# Altium schematic sheet Main_Trigger.SchDoc (part 1 of 2)
size A0; DocumentNumber: 1; SheetNumber: 1; SheetTotal: 6
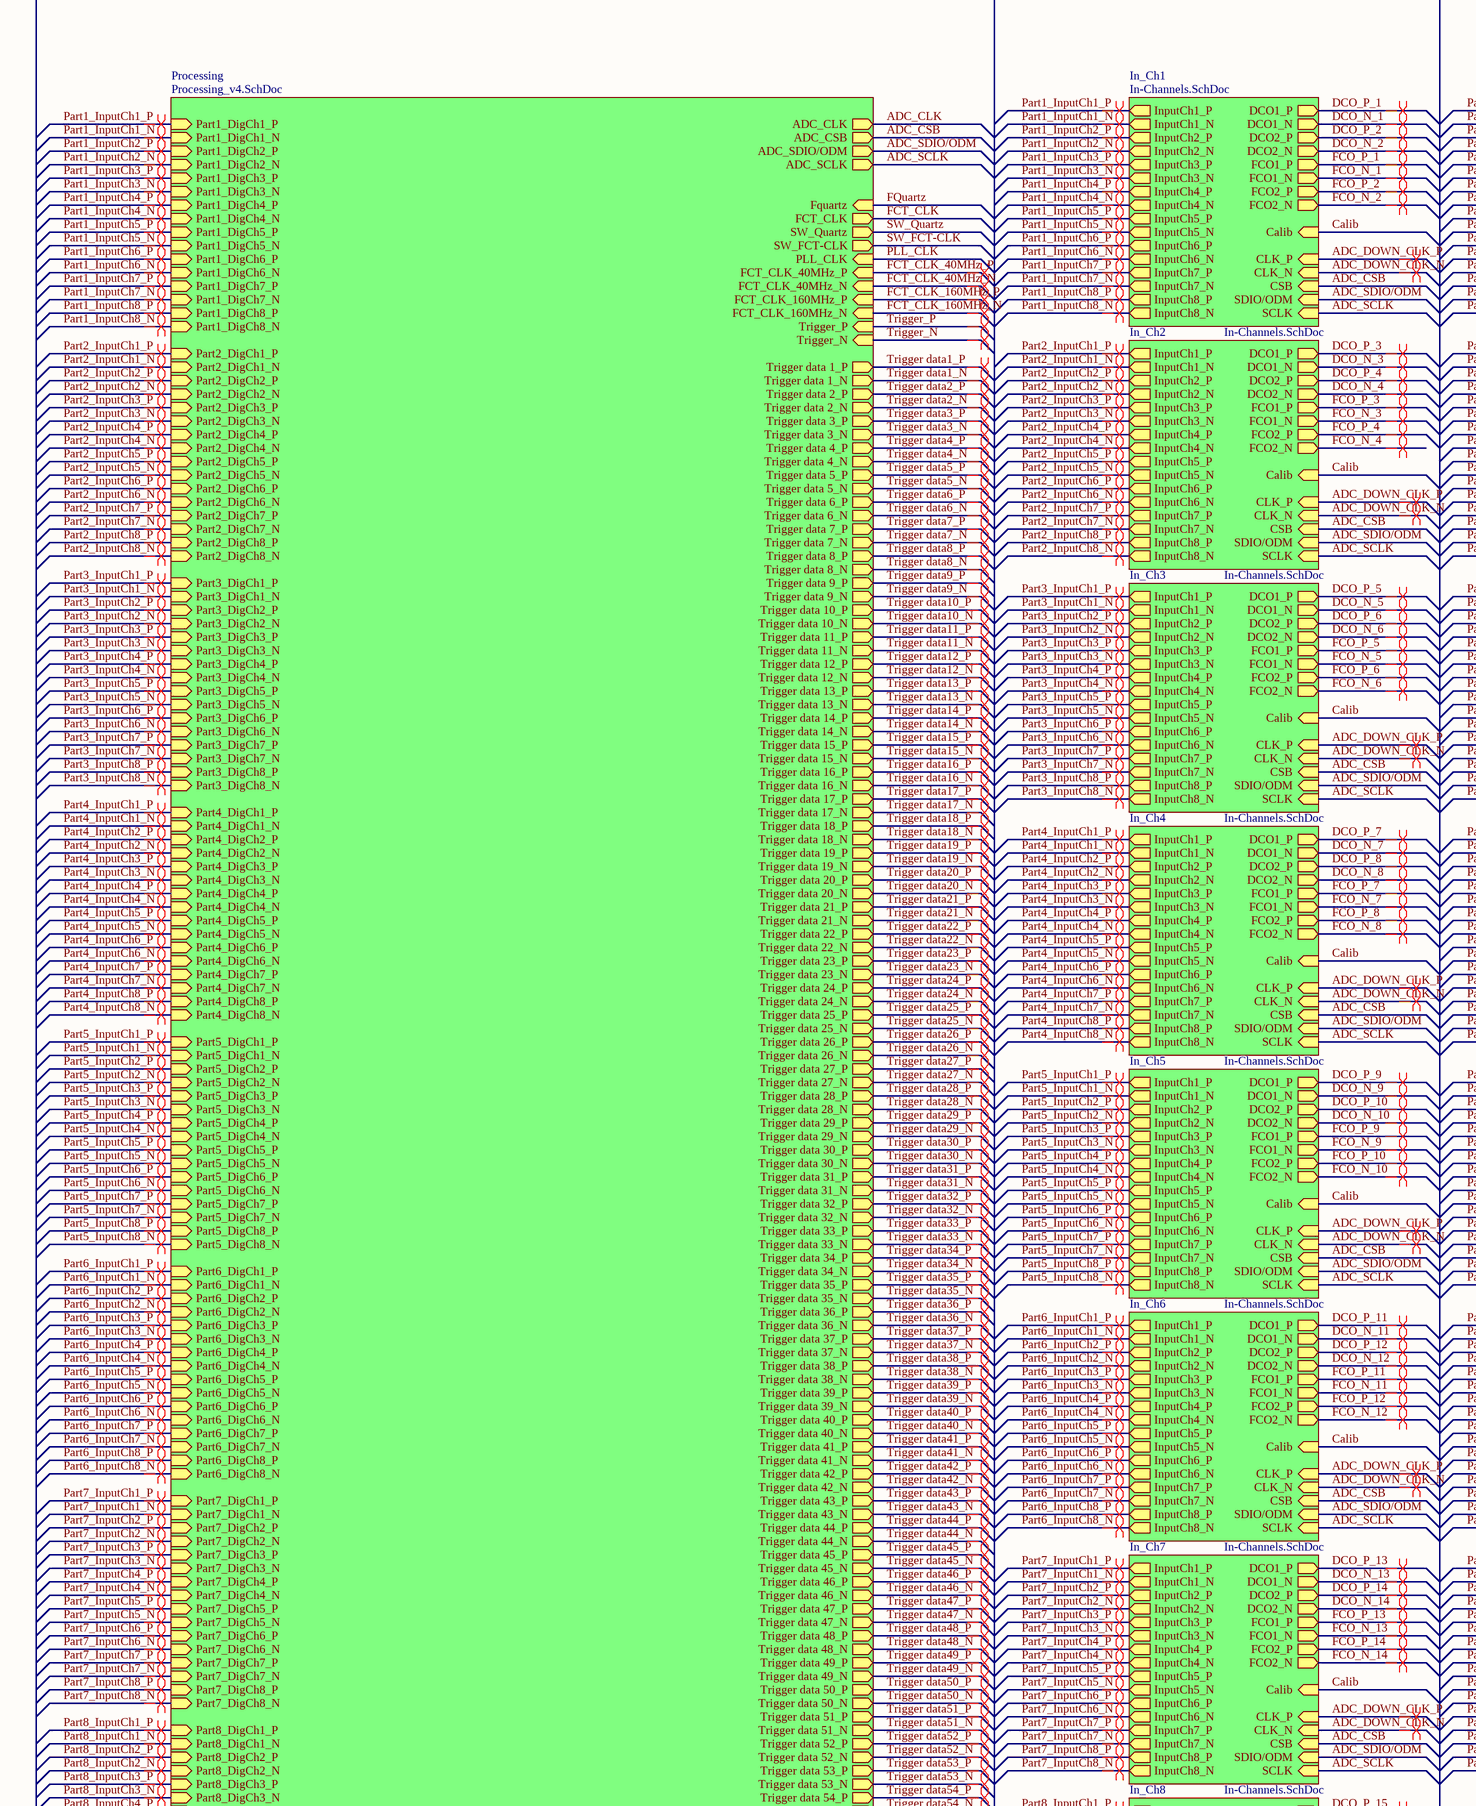
[diagram p0: Main_Trigger.SchDoc, top left]
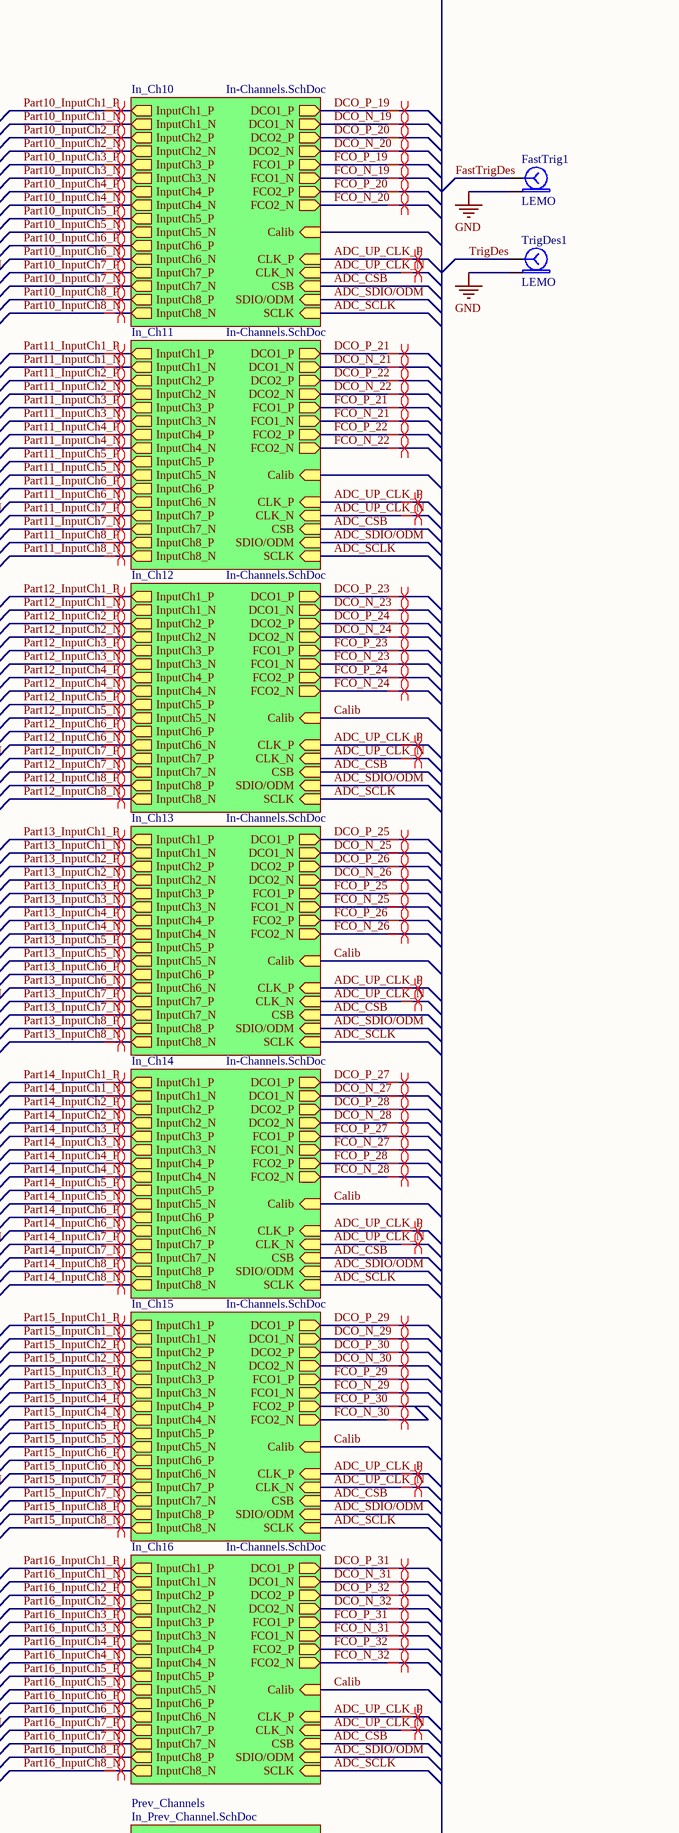
[diagram p1: Main_Trigger.SchDoc, top middle]
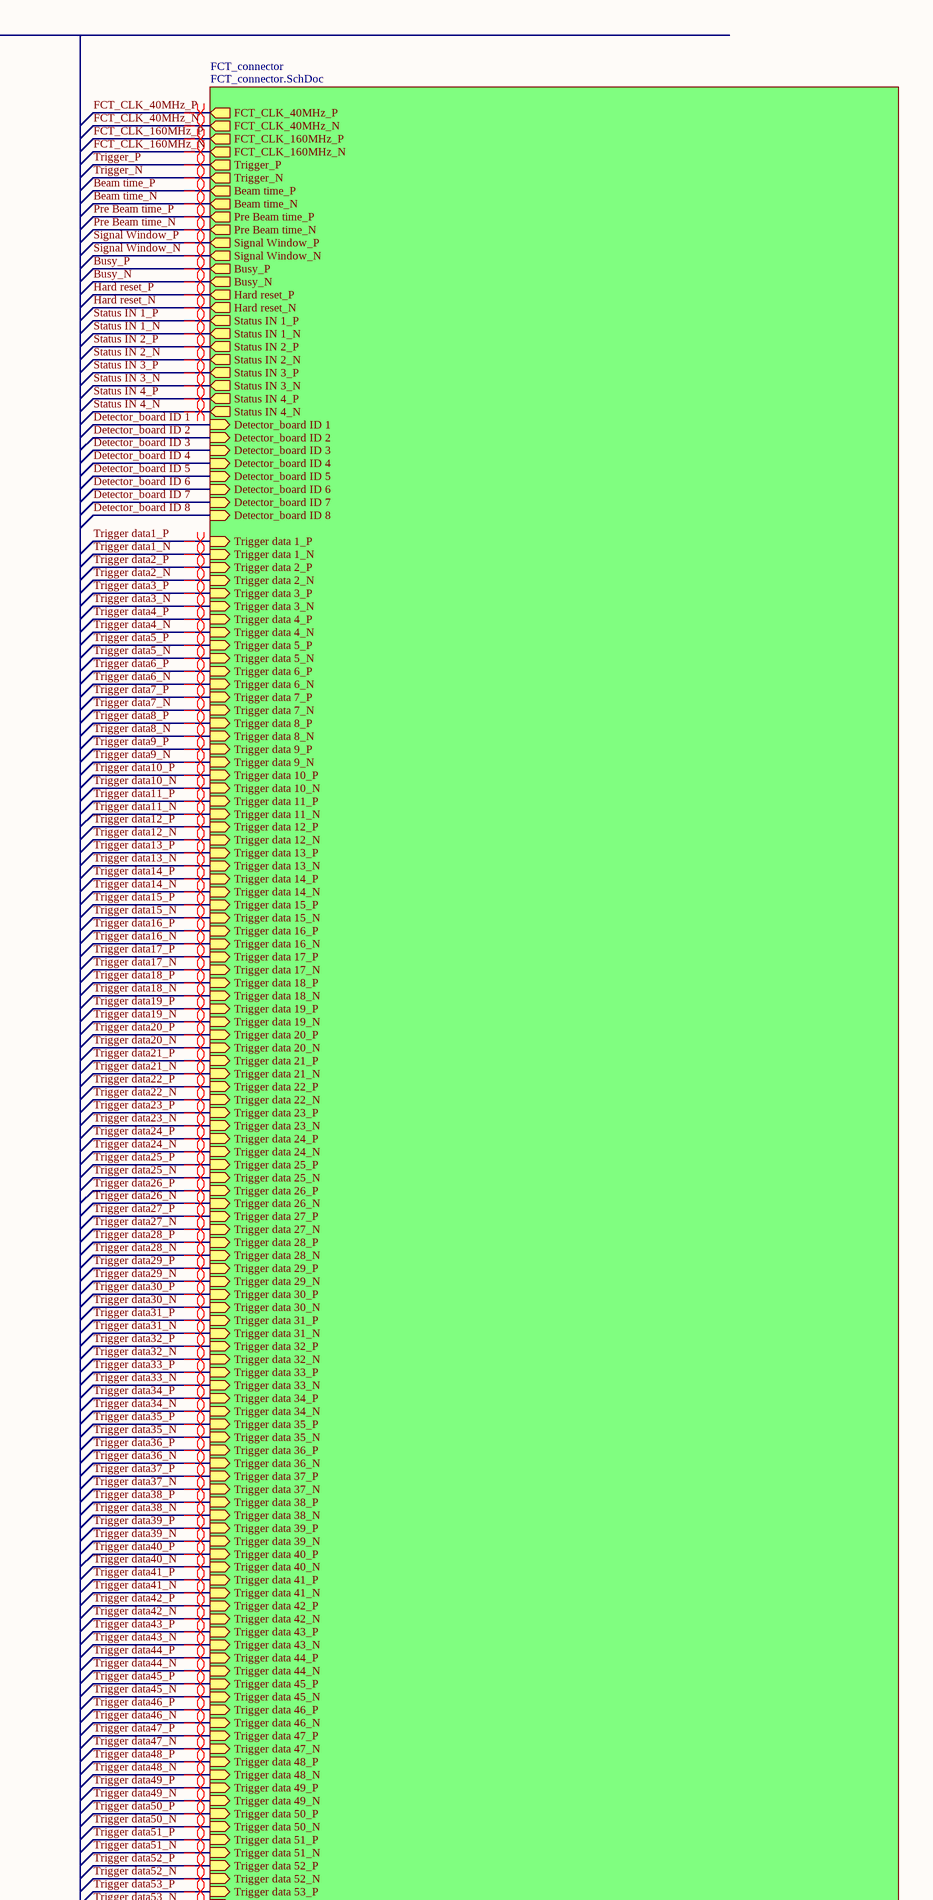
[diagram p2: Main_Trigger.SchDoc, top right]
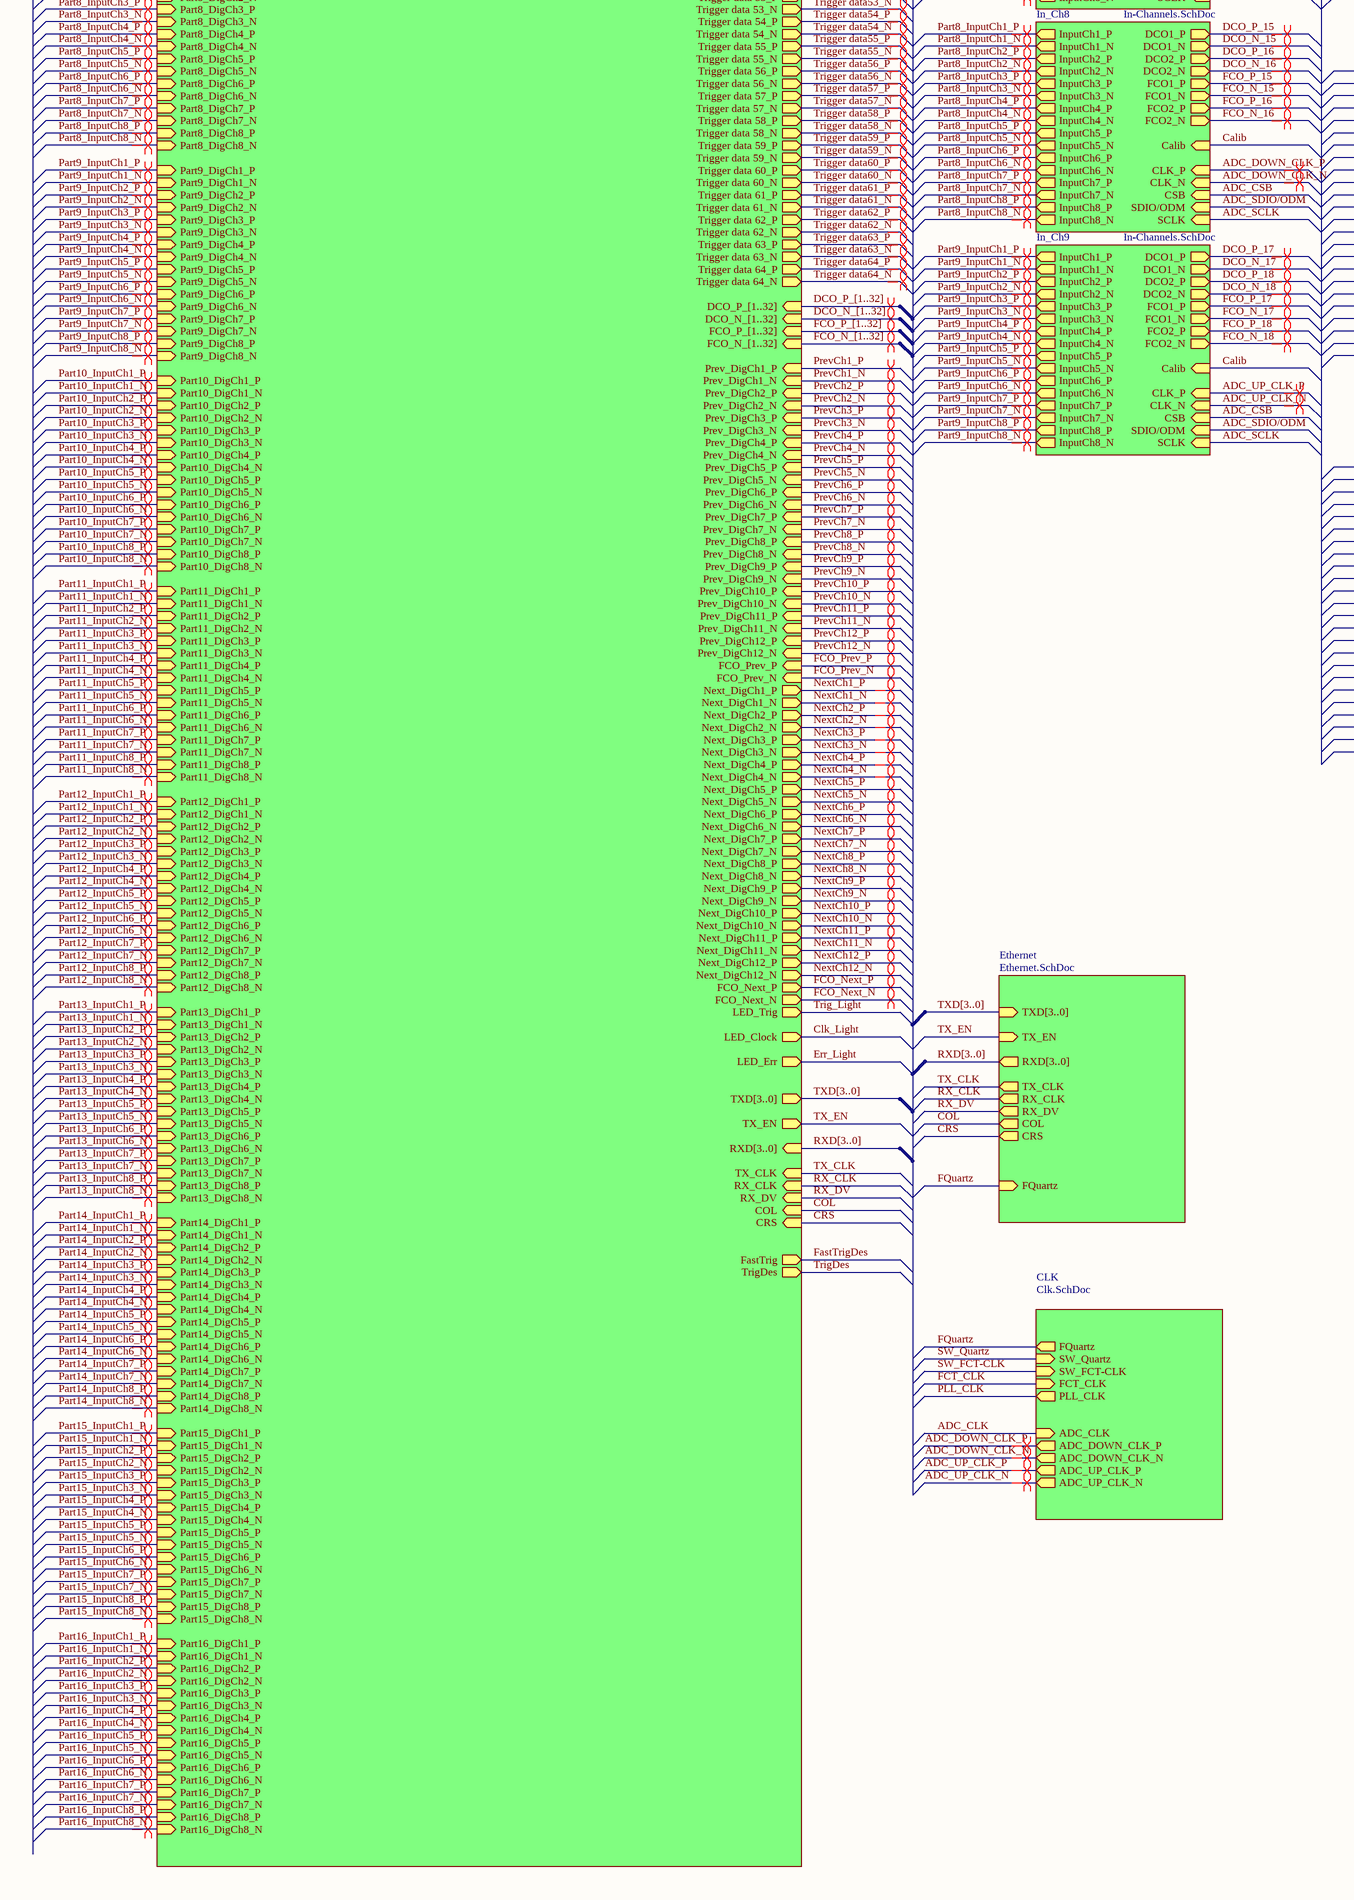
[diagram p3: Main_Trigger.SchDoc, bottom left]
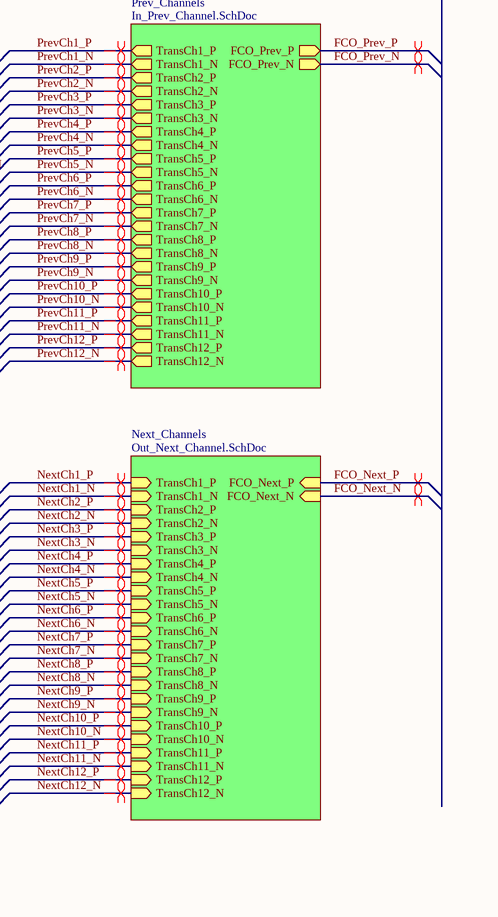
[diagram p4: Main_Trigger.SchDoc, bottom middle]
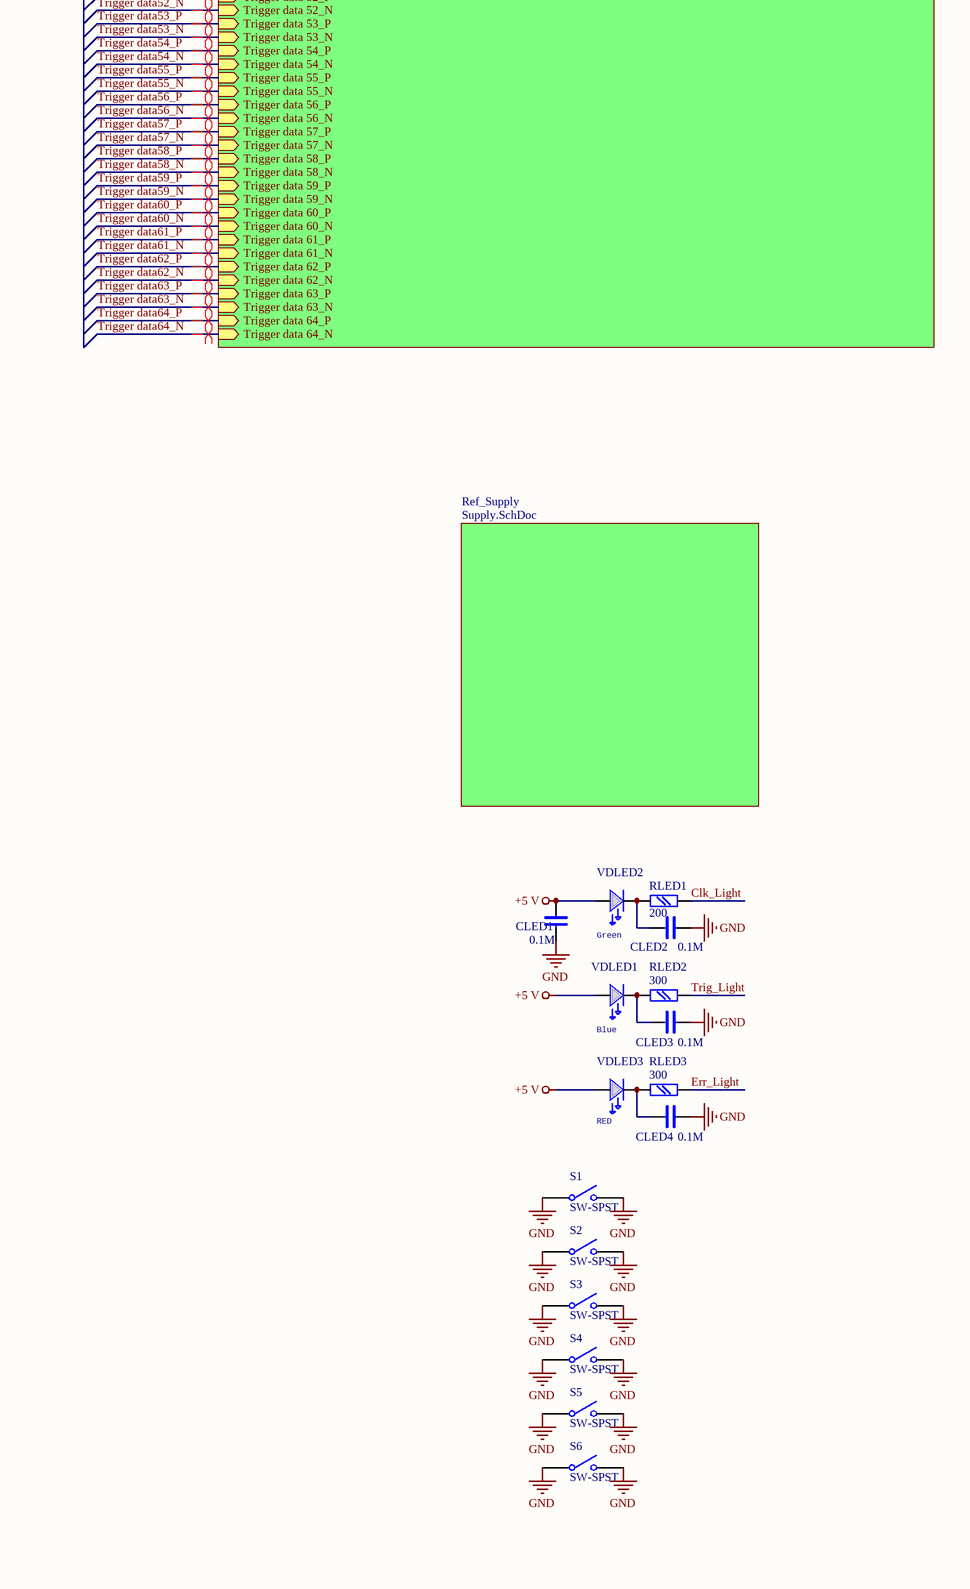
[diagram p5: Main_Trigger.SchDoc, bottom right]

## Parts
CLED1  0.1M  [chip0805]
CLED2  0.1M  [chip0805]
CLED3  0.1M  [chip0805]
CLED4  0.1M  [chip0805]
FastTrig1  LEMO  [LEMO]
RLED1  200  [chip0805]
RLED2  300  [chip0805]
RLED3  300  [chip0805]
S1  SW-SPST  [SPST-2]
S2  SW-SPST  [SPST-2]
S3  SW-SPST  [SPST-2]
S4  SW-SPST  [SPST-2]
S5  SW-SPST  [SPST-2]
S6  SW-SPST  [SPST-2]
TrigDes1  LEMO  [LEMO]
VDLED1  LED  [CHIP1206]  (value not drawn)
VDLED2  LED  [CHIP0805]  (value not drawn)
VDLED3  LED  [CHIP1206]  (value not drawn)

## Sub-sheets
CLK = Clk.SchDoc: FQuartz (out), ADC_DOWN_CLK_P (out), ADC_DOWN_CLK_N (out), ADC_UP_CLK_P (out), ADC_UP_CLK_N (out), SW_Quartz (in), SW_FCT-CLK (in), PLL_CLK (out), FCT_CLK (in), ADC_CLK (in)
Ethernet = Ethernet.SchDoc: COL (out), TX_EN (in), TX_CLK (out), RX_CLK (out), RX_DV (out), TXD[3..0] (in), RXD[3..0] (out), CRS (out), FQuartz (in)
FCT_connector = FCT_connector.SchDoc: FCT_CLK_40MHz_P (out), FCT_CLK_40MHz_N (out), FCT_CLK_160MHz_P (out), FCT_CLK_160MHz_N (out), Trigger_P (out), Trigger_N (out), Beam time_P (out), Beam time_N (out), Pre Beam time_P (out), Pre Beam time_N (out), Signal Window_P (out), Signal Window_N (out), Busy_P (out), Busy_N (out), Hard reset_P (out), Hard reset_N (out), Status IN 1_P (out), Status IN 1_N (out), Status IN 2_P (out), Status IN 2_N (out), Status IN 3_P (out), Status IN 3_N (out), Status IN 4_P (out), Status IN 4_N (out), Detector_board ID 1 (in), Detector_board ID 2 (in), Detector_board ID 3 (in), Detector_board ID 4 (in), Detector_board ID 5 (in), Detector_board ID 6 (in), Detector_board ID 7 (in), Detector_board ID 8 (in), Trigger data 1_P (in), Trigger data 1_N (in), Trigger data 2_P (in), Trigger data 2_N (in), Trigger data 3_P (in), Trigger data 3_N (in), Trigger data 4_P (in), Trigger data 4_N (in), Trigger data 5_P (in), Trigger data 5_N (in), Trigger data 6_P (in), Trigger data 6_N (in), Trigger data 7_P (in), Trigger data 7_N (in), Trigger data 8_P (in), Trigger data 8_N (in), Trigger data 9_P (in), Trigger data 9_N (in), Trigger data 10_P (in), Trigger data 10_N (in), Trigger data 11_P (in), Trigger data 11_N (in), Trigger data 12_P (in), Trigger data 12_N (in), Trigger data 13_P (in), Trigger data 13_N (in), Trigger data 14_P (in), Trigger data 14_N (in), Trigger data 15_P (in), Trigger data 15_N (in), Trigger data 16_P (in), Trigger data 16_N (in), Trigger data 17_P (in), Trigger data 17_N (in), Trigger data 18_P (in), Trigger data 18_N (in), Trigger data 19_P (in), Trigger data 19_N (in), Trigger data 20_P (in), Trigger data 20_N (in), Trigger data 21_P (in), Trigger data 21_N (in), Trigger data 22_P (in), Trigger data 22_N (in), Trigger data 23_P (in), Trigger data 23_N (in), Trigger data 24_P (in), Trigger data 24_N (in), Trigger data 25_P (in), Trigger data 25_N (in), Trigger data 26_P (in), Trigger data 26_N (in), Trigger data 27_P (in), Trigger data 27_N (in), Trigger data 28_P (in), Trigger data 28_N (in), Trigger data 29_P (in), Trigger data 29_N (in), Trigger data 30_P (in), Trigger data 30_N (in), Trigger data 31_P (in), Trigger data 31_N (in), Trigger data 32_P (in), Trigger data 32_N (in), Trigger data 33_P (in), Trigger data 33_N (in), Trigger data 34_P (in), Trigger data 34_N (in), Trigger data 35_P (in), Trigger data 35_N (in), Trigger data 36_P (in), Trigger data 36_N (in), Trigger data 37_P (in), Trigger data 37_N (in), Trigger data 38_P (in), Trigger data 38_N (in), Trigger data 39_P (in), Trigger data 39_N (in), Trigger data 40_P (in), Trigger data 40_N (in), Trigger data 41_P (in), Trigger data 41_N (in), Trigger data 42_P (in), Trigger data 42_N (in), Trigger data 43_P (in), Trigger data 43_N (in), Trigger data 44_P (in), Trigger data 44_N (in), Trigger data 45_P (in), Trigger data 45_N (in), Trigger data 46_P (in), Trigger data 46_N (in), Trigger data 47_P (in), Trigger data 47_N (in), Trigger data 48_P (in), Trigger data 48_N (in), Trigger data 49_P (in), Trigger data 49_N (in), Trigger data 50_P (in), Trigger data 50_N (in), Trigger data 51_P (in), Trigger data 51_N (in), Trigger data 52_P (in), Trigger data 52_N (in), Trigger data 53_P (in), Trigger data 53_N (in), Trigger data 54_P (in), Trigger data 54_N (in), Trigger data 55_P (in), Trigger data 55_N (in), Trigger data 56_P (in), Trigger data 56_N (in), Trigger data 57_P (in), Trigger data 57_N (in), Trigger data 58_P (in), Trigger data 58_N (in), Trigger data 59_P (in), Trigger data 59_N (in), Trigger data 60_P (in), Trigger data 60_N (in), Trigger data 61_P (in), Trigger data 61_N (in), Trigger data 62_P (in), Trigger data 62_N (in), Trigger data 63_P (in), Trigger data 63_N (in), Trigger data 64_P (in), Trigger data 64_N (in)
In_Ch1 = In-Channels.SchDoc: InputCh1_P (out), InputCh1_N (out), InputCh2_P (out), InputCh2_N (out), InputCh3_P (out), InputCh3_N (out), InputCh4_P (out), InputCh4_N (out), InputCh5_P (out), InputCh5_N (out), InputCh6_P (out), InputCh6_N (out), InputCh7_P (out), InputCh7_N (out), InputCh8_P (out), InputCh8_N (out), CLK_P (in), CLK_N (in), CSB (in), SDIO/ODM (in), SCLK (in), Calib (in), DCO1_P (out), DCO1_N (out), DCO2_N (out), DCO2_P (out), FCO1_P (out), FCO1_N (out), FCO2_N (out), FCO2_P (out)
In_Ch2 = In-Channels.SchDoc: InputCh1_P (out), InputCh1_N (out), InputCh2_P (out), InputCh2_N (out), InputCh3_P (out), InputCh3_N (out), InputCh4_P (out), InputCh4_N (out), InputCh5_P (out), InputCh5_N (out), InputCh6_P (out), InputCh6_N (out), InputCh7_P (out), InputCh7_N (out), InputCh8_P (out), InputCh8_N (out), CLK_P (in), CLK_N (in), CSB (in), SDIO/ODM (in), SCLK (in), Calib (in), DCO1_P (out), DCO1_N (out), DCO2_N (out), DCO2_P (out), FCO1_P (out), FCO1_N (out), FCO2_N (out), FCO2_P (out)
In_Ch3 = In-Channels.SchDoc: InputCh1_P (out), InputCh1_N (out), InputCh2_P (out), InputCh2_N (out), InputCh3_P (out), InputCh3_N (out), InputCh4_P (out), InputCh4_N (out), InputCh5_P (out), InputCh5_N (out), InputCh6_P (out), InputCh6_N (out), InputCh7_P (out), InputCh7_N (out), InputCh8_P (out), InputCh8_N (out), CLK_P (in), CLK_N (in), CSB (in), SDIO/ODM (in), SCLK (in), Calib (in), DCO1_P (out), DCO1_N (out), DCO2_N (out), DCO2_P (out), FCO1_P (out), FCO1_N (out), FCO2_N (out), FCO2_P (out)
In_Ch4 = In-Channels.SchDoc: InputCh1_P (out), InputCh1_N (out), InputCh2_P (out), InputCh2_N (out), InputCh3_P (out), InputCh3_N (out), InputCh4_P (out), InputCh4_N (out), InputCh5_P (out), InputCh5_N (out), InputCh6_P (out), InputCh6_N (out), InputCh7_P (out), InputCh7_N (out), InputCh8_P (out), InputCh8_N (out), CLK_P (in), CLK_N (in), CSB (in), SDIO/ODM (in), SCLK (in), Calib (in), DCO1_P (out), DCO1_N (out), DCO2_N (out), DCO2_P (out), FCO1_P (out), FCO1_N (out), FCO2_N (out), FCO2_P (out)
In_Ch5 = In-Channels.SchDoc: InputCh1_P (out), InputCh1_N (out), InputCh2_P (out), InputCh2_N (out), InputCh3_P (out), InputCh3_N (out), InputCh4_P (out), InputCh4_N (out), InputCh5_P (out), InputCh5_N (out), InputCh6_P (out), InputCh6_N (out), InputCh7_P (out), InputCh7_N (out), InputCh8_P (out), InputCh8_N (out), CLK_P (in), CLK_N (in), CSB (in), SDIO/ODM (in), SCLK (in), Calib (in), DCO1_P (out), DCO1_N (out), DCO2_N (out), DCO2_P (out), FCO1_P (out), FCO1_N (out), FCO2_N (out), FCO2_P (out)
In_Ch6 = In-Channels.SchDoc: InputCh1_P (out), InputCh1_N (out), InputCh2_P (out), InputCh2_N (out), InputCh3_P (out), InputCh3_N (out), InputCh4_P (out), InputCh4_N (out), InputCh5_P (out), InputCh5_N (out), InputCh6_P (out), InputCh6_N (out), InputCh7_P (out), InputCh7_N (out), InputCh8_P (out), InputCh8_N (out), CLK_P (in), CLK_N (in), CSB (in), SDIO/ODM (in), SCLK (in), Calib (in), DCO1_P (out), DCO1_N (out), DCO2_N (out), DCO2_P (out), FCO1_P (out), FCO1_N (out), FCO2_N (out), FCO2_P (out)
In_Ch7 = In-Channels.SchDoc: InputCh1_P (out), InputCh1_N (out), InputCh2_P (out), InputCh2_N (out), InputCh3_P (out), InputCh3_N (out), InputCh4_P (out), InputCh4_N (out), InputCh5_P (out), InputCh5_N (out), InputCh6_P (out), InputCh6_N (out), InputCh7_P (out), InputCh7_N (out), InputCh8_P (out), InputCh8_N (out), CLK_P (in), CLK_N (in), CSB (in), SDIO/ODM (in), SCLK (in), Calib (in), DCO1_P (out), DCO1_N (out), DCO2_N (out), DCO2_P (out), FCO1_P (out), FCO1_N (out), FCO2_N (out), FCO2_P (out)
In_Ch8 = In-Channels.SchDoc: InputCh1_P (out), InputCh1_N (out), InputCh2_P (out), InputCh2_N (out), InputCh3_P (out), InputCh3_N (out), InputCh4_P (out), InputCh4_N (out), InputCh5_P (out), InputCh5_N (out), InputCh6_P (out), InputCh6_N (out), InputCh7_P (out), InputCh7_N (out), InputCh8_P (out), InputCh8_N (out), CLK_P (in), CLK_N (in), CSB (in), SDIO/ODM (in), SCLK (in), Calib (in), DCO1_P (out), DCO1_N (out), DCO2_N (out), DCO2_P (out), FCO1_P (out), FCO1_N (out), FCO2_N (out), FCO2_P (out)
In_Ch9 = In-Channels.SchDoc: InputCh1_P (out), InputCh1_N (out), InputCh2_P (out), InputCh2_N (out), InputCh3_P (out), InputCh3_N (out), InputCh4_P (out), InputCh4_N (out), InputCh5_P (out), InputCh5_N (out), InputCh6_P (out), InputCh6_N (out), InputCh7_P (out), InputCh7_N (out), InputCh8_P (out), InputCh8_N (out), CLK_P (in), CLK_N (in), CSB (in), SDIO/ODM (in), SCLK (in), Calib (in), DCO1_P (out), DCO1_N (out), DCO2_N (out), DCO2_P (out), FCO1_P (out), FCO1_N (out), FCO2_N (out), FCO2_P (out)
In_Ch10 = In-Channels.SchDoc: InputCh1_P (out), InputCh1_N (out), InputCh2_P (out), InputCh2_N (out), InputCh3_P (out), InputCh3_N (out), InputCh4_P (out), InputCh4_N (out), InputCh5_P (out), InputCh5_N (out), InputCh6_P (out), InputCh6_N (out), InputCh7_P (out), InputCh7_N (out), InputCh8_P (out), InputCh8_N (out), CLK_P (in), CLK_N (in), CSB (in), SDIO/ODM (in), SCLK (in), Calib (in), DCO1_P (out), DCO1_N (out), DCO2_N (out), DCO2_P (out), FCO1_P (out), FCO1_N (out), FCO2_N (out), FCO2_P (out)
In_Ch11 = In-Channels.SchDoc: InputCh1_P (out), InputCh1_N (out), InputCh2_P (out), InputCh2_N (out), InputCh3_P (out), InputCh3_N (out), InputCh4_P (out), InputCh4_N (out), InputCh5_P (out), InputCh5_N (out), InputCh6_P (out), InputCh6_N (out), InputCh7_P (out), InputCh7_N (out), InputCh8_P (out), InputCh8_N (out), CLK_P (in), CLK_N (in), CSB (in), SDIO/ODM (in), SCLK (in), Calib (in), DCO1_P (out), DCO1_N (out), DCO2_N (out), DCO2_P (out), FCO1_P (out), FCO1_N (out), FCO2_N (out), FCO2_P (out)
In_Ch12 = In-Channels.SchDoc: InputCh1_P (out), InputCh1_N (out), InputCh2_P (out), InputCh2_N (out), InputCh3_P (out), InputCh3_N (out), InputCh4_P (out), InputCh4_N (out), InputCh5_P (out), InputCh5_N (out), InputCh6_P (out), InputCh6_N (out), InputCh7_P (out), InputCh7_N (out), InputCh8_P (out), InputCh8_N (out), CLK_P (in), CLK_N (in), CSB (in), SDIO/ODM (in), SCLK (in), Calib (in), DCO1_P (out), DCO1_N (out), DCO2_N (out), DCO2_P (out), FCO1_P (out), FCO1_N (out), FCO2_N (out), FCO2_P (out)
In_Ch13 = In-Channels.SchDoc: InputCh1_P (out), InputCh1_N (out), InputCh2_P (out), InputCh2_N (out), InputCh3_P (out), InputCh3_N (out), InputCh4_P (out), InputCh4_N (out), InputCh5_P (out), InputCh5_N (out), InputCh6_P (out), InputCh6_N (out), InputCh7_P (out), InputCh7_N (out), InputCh8_P (out), InputCh8_N (out), CLK_P (in), CLK_N (in), CSB (in), SDIO/ODM (in), SCLK (in), Calib (in), DCO1_P (out), DCO1_N (out), DCO2_N (out), DCO2_P (out), FCO1_P (out), FCO1_N (out), FCO2_N (out), FCO2_P (out)
In_Ch14 = In-Channels.SchDoc: InputCh1_P (out), InputCh1_N (out), InputCh2_P (out), InputCh2_N (out), InputCh3_P (out), InputCh3_N (out), InputCh4_P (out), InputCh4_N (out), InputCh5_P (out), InputCh5_N (out), InputCh6_P (out), InputCh6_N (out), InputCh7_P (out), InputCh7_N (out), InputCh8_P (out), InputCh8_N (out), CLK_P (in), CLK_N (in), CSB (in), SDIO/ODM (in), SCLK (in), Calib (in), DCO1_P (out), DCO1_N (out), DCO2_N (out), DCO2_P (out), FCO1_P (out), FCO1_N (out), FCO2_N (out), FCO2_P (out)
In_Ch15 = In-Channels.SchDoc: InputCh1_P (out), InputCh1_N (out), InputCh2_P (out), InputCh2_N (out), InputCh3_P (out), InputCh3_N (out), InputCh4_P (out), InputCh4_N (out), InputCh5_P (out), InputCh5_N (out), InputCh6_P (out), InputCh6_N (out), InputCh7_P (out), InputCh7_N (out), InputCh8_P (out), InputCh8_N (out), CLK_P (in), CLK_N (in), CSB (in), SDIO/ODM (in), SCLK (in), Calib (in), DCO1_P (out), DCO1_N (out), DCO2_N (out), DCO2_P (out), FCO1_P (out), FCO1_N (out), FCO2_N (out), FCO2_P (out)
In_Ch16 = In-Channels.SchDoc: InputCh1_P (out), InputCh1_N (out), InputCh2_P (out), InputCh2_N (out), InputCh3_P (out), InputCh3_N (out), InputCh4_P (out), InputCh4_N (out), InputCh5_P (out), InputCh5_N (out), InputCh6_P (out), InputCh6_N (out), InputCh7_P (out), InputCh7_N (out), InputCh8_P (out), InputCh8_N (out), CLK_P (in), CLK_N (in), CSB (in), SDIO/ODM (in), SCLK (in), Calib (in), DCO1_P (out), DCO1_N (out), DCO2_N (out), DCO2_P (out), FCO1_P (out), FCO1_N (out), FCO2_N (out), FCO2_P (out)
Next_Channels = Out_Next_Channel.SchDoc: TransCh1_P (in), TransCh1_N (in), TransCh2_P (in), TransCh2_N (in), TransCh3_P (in), TransCh3_N (in), TransCh4_P (in), TransCh4_N (in), TransCh5_P (in), TransCh5_N (in), TransCh6_P (in), TransCh6_N (in), TransCh7_P (in), TransCh7_N (in), TransCh8_P (in), TransCh8_N (in), TransCh9_P (in), TransCh9_N (in), TransCh10_P (in), TransCh10_N (in), TransCh11_P (in), TransCh11_N (in), TransCh12_P (in), TransCh12_N (in), FCO_Next_P (in), FCO_Next_N (in)
Prev_Channels = In_Prev_Channel.SchDoc: TransCh1_P (out), TransCh1_N (out), TransCh2_P (out), TransCh2_N (out), TransCh3_P (out), TransCh3_N (out), TransCh4_P (out), TransCh4_N (out), TransCh5_P (out), TransCh5_N (out), TransCh6_P (out), TransCh6_N (out), TransCh7_P (out), TransCh7_N (out), TransCh8_P (out), TransCh8_N (out), TransCh9_P (out), TransCh9_N (out), TransCh10_P (out), TransCh10_N (out), TransCh11_P (out), TransCh11_N (out), TransCh12_P (out), TransCh12_N (out), FCO_Prev_P (out), FCO_Prev_N (out)
Processing = Processing_v4.SchDoc: Part1_DigCh1_P (in), Part1_DigCh1_N (in), Part1_DigCh2_P (in), Part1_DigCh2_N (in), Part1_DigCh3_P (in), Part1_DigCh3_N (in), Part1_DigCh4_P (in), Part1_DigCh4_N (in), Part1_DigCh5_P (in), Part1_DigCh5_N (in), Part1_DigCh6_P (in), Part1_DigCh6_N (in), Part1_DigCh7_P (in), Part1_DigCh7_N (in), Part1_DigCh8_P (in), Part1_DigCh8_N (in), Part2_DigCh1_P (in), Part2_DigCh1_N (in), Part2_DigCh2_P (in), Part2_DigCh2_N (in), Part2_DigCh3_P (in), Part2_DigCh3_N (in), Part2_DigCh4_P (in), Part2_DigCh4_N (in), Part2_DigCh5_P (in), Part2_DigCh5_N (in), Part2_DigCh6_P (in), Part2_DigCh6_N (in), Part2_DigCh7_P (in), Part2_DigCh7_N (in), Part2_DigCh8_P (in), Part2_DigCh8_N (in), Part3_DigCh1_P (in), Part3_DigCh1_N (in), Part3_DigCh2_P (in), Part3_DigCh2_N (in), Part3_DigCh3_P (in), Part3_DigCh3_N (in), Part3_DigCh4_P (in), Part3_DigCh4_N (in), Part3_DigCh5_P (in), Part3_DigCh5_N (in), Part3_DigCh6_P (in), Part3_DigCh6_N (in), Part3_DigCh7_P (in), Part3_DigCh7_N (in), Part3_DigCh8_P (in), Part3_DigCh8_N (in), Part4_DigCh1_P (in), Part4_DigCh1_N (in), Part4_DigCh2_P (in), Part4_DigCh2_N (in), Part4_DigCh3_P (in), Part4_DigCh3_N (in), Part4_DigCh4_P (in), Part4_DigCh4_N (in), Part4_DigCh5_P (in), Part4_DigCh5_N (in), Part4_DigCh6_P (in), Part4_DigCh6_N (in), Part4_DigCh7_P (in), Part4_DigCh7_N (in), Part4_DigCh8_P (in), Part4_DigCh8_N (in), Part5_DigCh1_P (in), Part5_DigCh1_N (in), Part5_DigCh2_P (in), Part5_DigCh2_N (in), Part5_DigCh3_P (in), Part5_DigCh3_N (in), Part5_DigCh4_P (in), Part5_DigCh4_N (in), Part5_DigCh5_P (in), Part5_DigCh5_N (in), Part5_DigCh6_P (in), Part5_DigCh6_N (in), Part5_DigCh7_P (in), Part5_DigCh7_N (in), Part5_DigCh8_P (in), Part5_DigCh8_N (in), ADC_CLK (out), ADC_CSB (out), ADC_SDIO/ODM (out), ADC_SCLK (out), FCT_CLK_40MHz_P (in), FCT_CLK_40MHz_N (in), FCT_CLK_160MHz_P (in), FCT_CLK_160MHz_N (in), Trigger_P (in), Trigger_N (in), Trigger data 1_P (out), Trigger data 1_N (out), Trigger data 2_P (out), Trigger data 2_N (out), Trigger data 3_P (out), Trigger data 3_N (out), Trigger data 4_P (out), Trigger data 4_N (out), Trigger data 5_P (out), Trigger data 5_N (out), Trigger data 6_P (out), Trigger data 6_N (out), Trigger data 7_P (out), Trigger data 7_N (out), Trigger data 8_P (out), Trigger data 8_N (out), Trigger data 9_P (out), Trigger data 9_N (out), Trigger data 10_P (out), Trigger data 10_N (out), Trigger data 11_P (out), Trigger data 11_N (out), Trigger data 12_P (out), Trigger data 12_N (out), Trigger data 13_P (out), Trigger data 13_N (out), Trigger data 14_P (out), Trigger data 14_N (out), Trigger data 15_P (out), Trigger data 15_N (out), Trigger data 16_P (out), Trigger data 16_N (out), Trigger data 17_P (out), Trigger data 17_N (out), Trigger data 18_P (out), Trigger data 18_N (out), Trigger data 19_P (out), Trigger data 19_N (out), Trigger data 20_P (out), Trigger data 20_N (out), Trigger data 21_P (out), Trigger data 21_N (out), Trigger data 22_P (out), Trigger data 22_N (out), Trigger data 23_P (out), Trigger data 23_N (out), Trigger data 24_P (out), Trigger data 24_N (out), Trigger data 25_P (out), Trigger data 25_N (out), Trigger data 26_P (out), Trigger data 26_N (out), Trigger data 27_P (out), Trigger data 27_N (out), Trigger data 28_P (out), Trigger data 28_N (out), Trigger data 29_P (out), Trigger data 29_N (out), Trigger data 30_P (out), Trigger data 30_N (out), Trigger data 31_P (out), Trigger data 31_N (out), Trigger data 32_P (out), Trigger data 32_N (out), Trigger data 33_P (out), Trigger data 33_N (out), Trigger data 34_P (out), Trigger data 34_N (out), Trigger data 35_P (out), Trigger data 35_N (out), Trigger data 36_P (out), Trigger data 36_N (out), Trigger data 37_P (out), Trigger data 37_N (out), Trigger data 38_P (out), Trigger data 38_N (out), Trigger data 39_P (out), Trigger data 39_N (out), Trigger data 40_P (out), Trigger data 40_N (out), Trigger data 41_P (out), Trigger data 41_N (out), Trigger data 42_P (out), Trigger data 42_N (out), Trigger data 43_P (out), Trigger data 43_N (out), Trigger data 44_P (out), Trigger data 44_N (out), Trigger data 45_P (out), Trigger data 45_N (out), Trigger data 46_P (out), Trigger data 46_N (out), Trigger data 47_P (out), Trigger data 47_N (out), Trigger data 48_P (out), Trigger data 48_N (out), Trigger data 49_P (out), Trigger data 49_N (out), Trigger data 50_P (out), Trigger data 50_N (out), Trigger data 51_P (out), Trigger data 51_N (out), Trigger data 52_P (out), Trigger data 52_N (out), Trigger data 53_P (out), Trigger data 53_N (out), Trigger data 54_P (out), Trigger data 54_N (out), Trigger data 55_P (out), Trigger data 55_N (out), Trigger data 56_P (out), Trigger data 56_N (out), Trigger data 57_P (out), Trigger data 57_N (out), Trigger data 58_P (out), Trigger data 58_N (out), Trigger data 59_P (out), Trigger data 59_N (out), Trigger data 60_P (out), Trigger data 60_N (out), Trigger data 61_P (out), Trigger data 61_N (out), Trigger data 62_P (out), Trigger data 62_N (out), Trigger data 63_P (out), Trigger data 63_N (out), Trigger data 64_P (out), Trigger data 64_N (out), LED_Trig (out), LED_Clock (out), LED_Err (out), Part6_DigCh1_P (in), Part6_DigCh1_N (in), Part6_DigCh2_P (in), Part6_DigCh2_N (in), Part6_DigCh3_P (in), Part6_DigCh3_N (in), Part6_DigCh4_P (in), Part6_DigCh4_N (in), Part6_DigCh5_P (in), Part6_DigCh5_N (in), Part6_DigCh6_P (in), Part6_DigCh6_N (in), Part6_DigCh7_P (in), Part6_DigCh7_N (in), Part6_DigCh8_P (in), Part6_DigCh8_N (in), Part7_DigCh1_P (in), Part7_DigCh1_N (in), Part7_DigCh2_P (in), Part7_DigCh2_N (in), Part7_DigCh3_P (in), Part7_DigCh3_N (in), Part7_DigCh4_P (in), Part7_DigCh4_N (in), Part7_DigCh5_P (in), Part7_DigCh5_N (in), Part7_DigCh6_P (in), Part7_DigCh6_N (in), Part7_DigCh7_P (in), Part7_DigCh7_N (in), Part7_DigCh8_P (in), Part7_DigCh8_N (in), Part8_DigCh1_P (in), Part8_DigCh1_N (in), Part8_DigCh2_P (in), Part8_DigCh2_N (in), Part8_DigCh3_P (in), Part8_DigCh3_N (in), Part8_DigCh4_P (in), Part8_DigCh4_N (in), Part8_DigCh5_P (in), Part8_DigCh5_N (in), Part8_DigCh6_P (in), Part8_DigCh6_N (in), Part8_DigCh7_P (in), Part8_DigCh7_N (in), Part8_DigCh8_P (in), Part8_DigCh8_N (in), Part9_DigCh1_P (in), Part9_DigCh1_N (in), Part9_DigCh2_P (in), Part9_DigCh2_N (in), Part9_DigCh3_P (in), Part9_DigCh3_N (in), Part9_DigCh4_P (in), Part9_DigCh4_N (in), Part9_DigCh5_P (in), Part9_DigCh5_N (in), Part9_DigCh6_P (in), Part9_DigCh6_N (in), Part9_DigCh7_P (in), Part9_DigCh7_N (in), Part9_DigCh8_P (in), Part9_DigCh8_N (in), COL (in), TX_EN (out), TX_CLK (in), RX_CLK (in), RX_DV (in), TXD[3..0] (out), CRS (in), RXD[3..0] (in), Part10_DigCh1_P (in), Part10_DigCh1_N (in), Part10_DigCh2_P (in), Part10_DigCh2_N (in), Part10_DigCh3_P (in), Part10_DigCh3_N (in), Part10_DigCh4_P (in), Part10_DigCh4_N (in), Part10_DigCh5_P (in), Part10_DigCh5_N (in), Part10_DigCh6_P (in), Part10_DigCh6_N (in), Part10_DigCh7_P (in), Part10_DigCh7_N (in), Part10_DigCh8_P (in), Part11_DigCh1_P (in), Part11_DigCh1_N (in), Part11_DigCh2_P (in), Part11_DigCh2_N (in), Part11_DigCh3_P (in), Part11_DigCh3_N (in), Part11_DigCh4_P (in), Part11_DigCh4_N (in), Part11_DigCh5_P (in), Part11_DigCh5_N (in), Part11_DigCh6_P (in), Part11_DigCh6_N (in), Part11_DigCh7_P (in), Part11_DigCh7_N (in), Part11_DigCh8_P (in), Part12_DigCh1_P (in), Part12_DigCh1_N (in), Part12_DigCh2_P (in), Part12_DigCh2_N (in), Part12_DigCh3_P (in), Part12_DigCh3_N (in), Part12_DigCh4_P (in), Part12_DigCh4_N (in), Part12_DigCh5_P (in), Part12_DigCh5_N (in), Part12_DigCh6_P (in), Part12_DigCh6_N (in), Part12_DigCh7_P (in), Part12_DigCh7_N (in), Part12_DigCh8_P (in), Part13_DigCh1_P (in), Part13_DigCh1_N (in), Part13_DigCh2_P (in), Part13_DigCh2_N (in), Part13_DigCh3_P (in), Part13_DigCh3_N (in), Part13_DigCh4_P (in), Part13_DigCh4_N (in), Part13_DigCh5_P (in), Part13_DigCh5_N (in), Part13_DigCh6_P (in), Part13_DigCh6_N (in), Part13_DigCh7_P (in), Part13_DigCh7_N (in), Part13_DigCh8_P (in), Part10_DigCh8_N (in), Part11_DigCh8_N (in), Part12_DigCh8_N (in), Part13_DigCh8_N (in), Part14_DigCh1_P (in), Part14_DigCh1_N (in), Part14_DigCh2_P (in), Part14_DigCh2_N (in), Part14_DigCh3_P (in), Part14_DigCh3_N (in), Part14_DigCh4_P (in), Part14_DigCh4_N (in), Part14_DigCh5_P (in), Part14_DigCh5_N (in), Part14_DigCh6_P (in), Part14_DigCh6_N (in), Part14_DigCh7_P (in), Part14_DigCh7_N (in), Part14_DigCh8_P (in), Part14_DigCh8_N (in), Part15_DigCh1_P (in), Part15_DigCh1_N (in), Part15_DigCh2_P (in), Part15_DigCh2_N (in), Part15_DigCh3_P (in), Part15_DigCh3_N (in), Part15_DigCh4_P (in), Part15_DigCh4_N (in), Part15_DigCh5_P (in), Part15_DigCh5_N (in), Part15_DigCh6_P (in), Part15_DigCh6_N (in), Part15_DigCh7_P (in), Part15_DigCh7_N (in), Part15_DigCh8_P (in), Part15_DigCh8_N (in), Part16_DigCh1_P (in), Part16_DigCh1_N (in), Part16_DigCh2_P (in), Part16_DigCh2_N (in), Part16_DigCh3_P (in), Part16_DigCh3_N (in), Part16_DigCh4_P (in), Part16_DigCh4_N (in), Part16_DigCh5_P (in), Part16_DigCh5_N (in), Part16_DigCh6_P (in), Part16_DigCh6_N (in), Part16_DigCh7_P (in), Part16_DigCh7_N (in), Part16_DigCh8_P (in), Part16_DigCh8_N (in), Fquartz (in), PLL_CLK (in), SW_Quartz (out), SW_FCT-CLK (out), FCT_CLK (out), Prev_DigCh1_P (in), Prev_DigCh1_N (in), Prev_DigCh2_P (in), Prev_DigCh2_N (in), Prev_DigCh3_P (in), Prev_DigCh3_N (in), Prev_DigCh4_P (in), Prev_DigCh4_N (in), Prev_DigCh5_P (in), Prev_DigCh5_N (in), Prev_DigCh6_P (in), Prev_DigCh6_N (in), Prev_DigCh7_P (in), Prev_DigCh7_N (in), Prev_DigCh8_P (in), Prev_DigCh8_N (in), Prev_DigCh9_P (in), Prev_DigCh9_N (in), Prev_DigCh10_P (in), Prev_DigCh10_N (in), Prev_DigCh11_P (in), Prev_DigCh11_N (in), Prev_DigCh12_P (in), Prev_DigCh12_N (in), DCO_P_[1..32] (in), DCO_N_[1..32] (in), FCO_P_[1..32] (in), FCO_N_[1..32] (in), FCO_Prev_P (in), FCO_Prev_N (in), FastTrig (out), TrigDes (out), Next_DigCh1_P (out), Next_DigCh1_N (out), Next_DigCh2_P (out), Next_DigCh2_N (out), Next_DigCh3_P (out), Next_DigCh3_N (out), Next_DigCh4_P (out), Next_DigCh4_N (out), Next_DigCh5_P (out), Next_DigCh5_N (out), Next_DigCh6_P (out), Next_DigCh6_N (out), Next_DigCh7_P (out), Next_DigCh7_N (out), Next_DigCh8_P (out), Next_DigCh8_N (out), Next_DigCh9_P (out), Next_DigCh9_N (out), Next_DigCh10_P (out), Next_DigCh10_N (out), Next_DigCh11_P (out), Next_DigCh11_N (out), Next_DigCh12_P (out), Next_DigCh12_N (out), FCO_Next_P (out), FCO_Next_N (out)
Ref_Supply = Supply.SchDoc: no entries